# EAGLE schematic V-00349-01 (EAGLE 7.2.0)
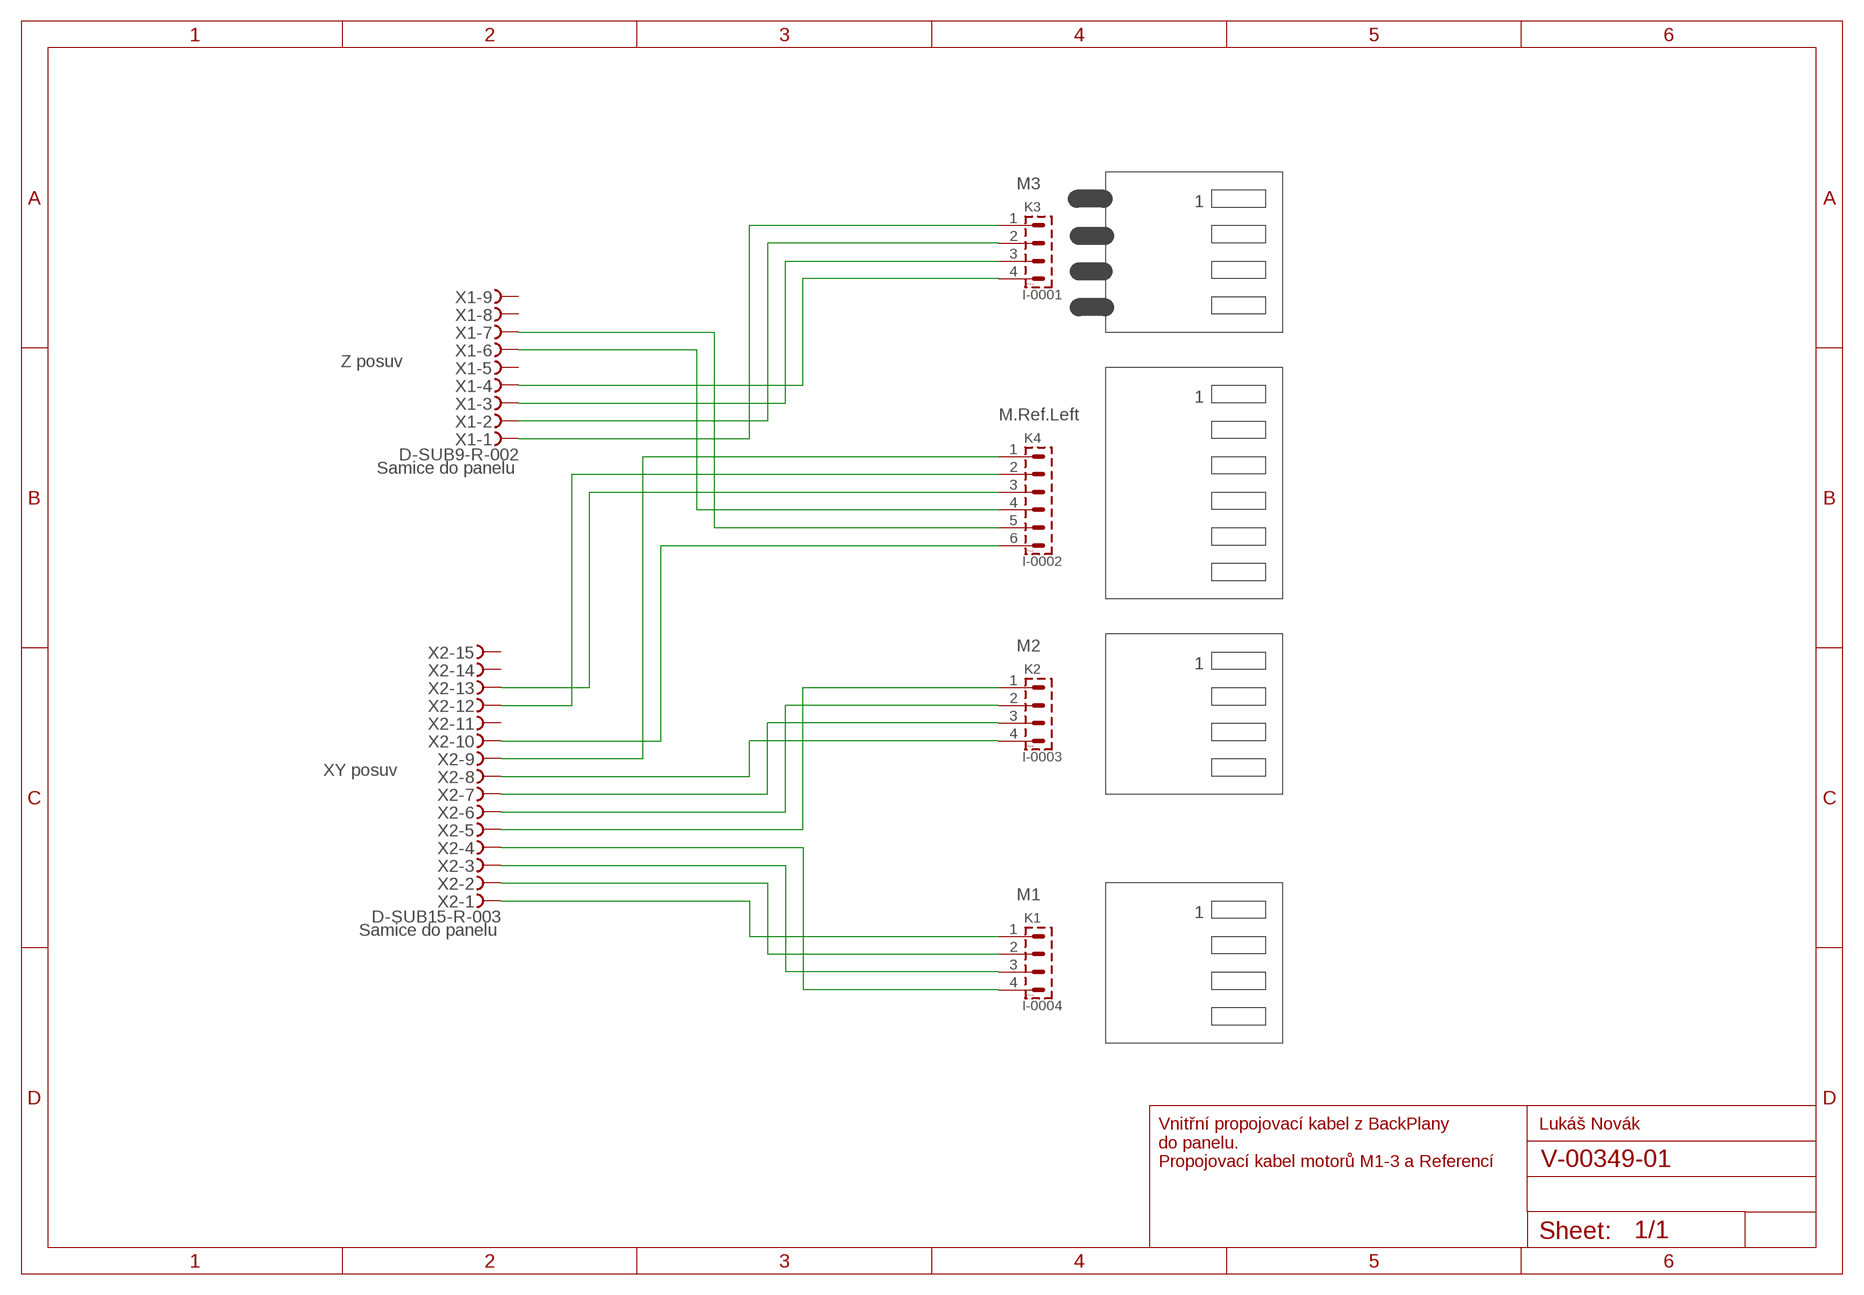
[diagram p0: schematic, sheet 1]

## Parts
K1  I-0004  PSH02-04P  [PSH02-04P]
K2  I-0003  PSH02-04P  [PSH02-04P]
K3  I-0001  PSH02-04P  [PSH02-04P]
K4  I-0002  PSH02-06P  [PSH02-06P]
X1  D-SUB9-R-002  D-SUB9-H2M09ST  [H2M09ST]
X2  D-SUB15-R-003  D-SUB15-H2M15ST  [H2M15ST]

## Nets
N$1: K3.1 X1.1
N$2: K3.2 X1.2
N$3: K3.3 X1.3
N$4: K3.4 X1.4
N$5: K4.1 X2.9
N$6: K4.2 X2.12
N$7: K4.3 X2.13
N$8: K4.4 X1.6
N$9: K4.5 X1.7
N$10: K4.6 X2.10
N$11: K1.1 X2.1
N$12: K1.2 X2.2
N$13: K1.3 X2.3
N$14: K1.4 X2.4
N$15: K2.1 X2.5
N$16: K2.2 X2.6
N$17: K2.3 X2.7
N$18: K2.4 X2.8
Unconnected: X1.5 X1.8 X1.9 X2.11 X2.14 X2.15

## Notes on the sheet
- M3
- 1
- Z posuv
- 1
- M.Ref.Left
- Samice do panelu
- M2
- 1
- XY posuv
- M1
- 1
- Samice do panelu
- Lukáš Novák
- Vnitřní propojovací kabel z BackPlany
  do panelu.
  Propojovací kabel motorů M1-3 a Referencí

## Library data of the parts
K1-K3 = #PaJa_konektory:PSH02-04: Konektory se zamkem - vidlice - 4pin
K4 = #PaJa_konektory:PSH02-06: Konektory se zamkem - vidlice - 6pin
X1 = con-thomas-betts:D-SUB9-: D-Subminiatur Connector Source: Electronioc Interconnects European Edition 1998; OC_FARNELL: unknown; OC_NEWARK: unknown
X2 = con-thomas-betts:D-SUB15-: D-Subminiatur Connector Source: Electronioc Interconnects European Edition 1998; OC_FARNELL: unknown; OC_NEWARK: unknown